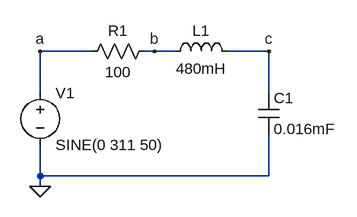
[diagram p0: schematic Draft1.asc]
Draft1.asc, the LTspice schematic file:
Version 4
SHEET 1 880 680
WIRE 32 64 -48 64
WIRE 128 64 112 64
WIRE 160 64 128 64
WIRE 304 64 240 64
WIRE -48 128 -48 64
WIRE 304 128 304 64
WIRE -48 256 -48 208
WIRE 304 256 304 192
WIRE 304 256 -48 256
WIRE -48 272 -48 256
FLAG -48 64 a
FLAG 128 64 b
FLAG 304 64 c
FLAG -48 272 0
SYMBOL voltage -48 112 R0
WINDOW 123 0 0 Left 2
WINDOW 39 0 0 Left 2
SYMATTR InstName V1
SYMATTR Value SINE(0 311 50)
SYMBOL res 128 48 R90
WINDOW 0 0 56 VBottom 2
WINDOW 3 32 56 VTop 2
SYMATTR InstName R1
SYMATTR Value 100
SYMBOL ind 144 80 R270
WINDOW 0 32 56 VTop 2
WINDOW 3 5 56 VBottom 2
SYMATTR InstName L1
SYMATTR Value 480mH
SYMBOL cap 288 128 R0
SYMATTR InstName C1
SYMATTR Value 0.016mF

The netlist it stands for:
* Draft1.asc
V1 a 0 SINE(0 311 50)
R1 b a 100
L1 b c 480mH
C1 c 0 0.016mF
.backanno
.end